# EAGLE design Soil_Moisture_Sensor_SMD-cr (EAGLE 7.4.0)
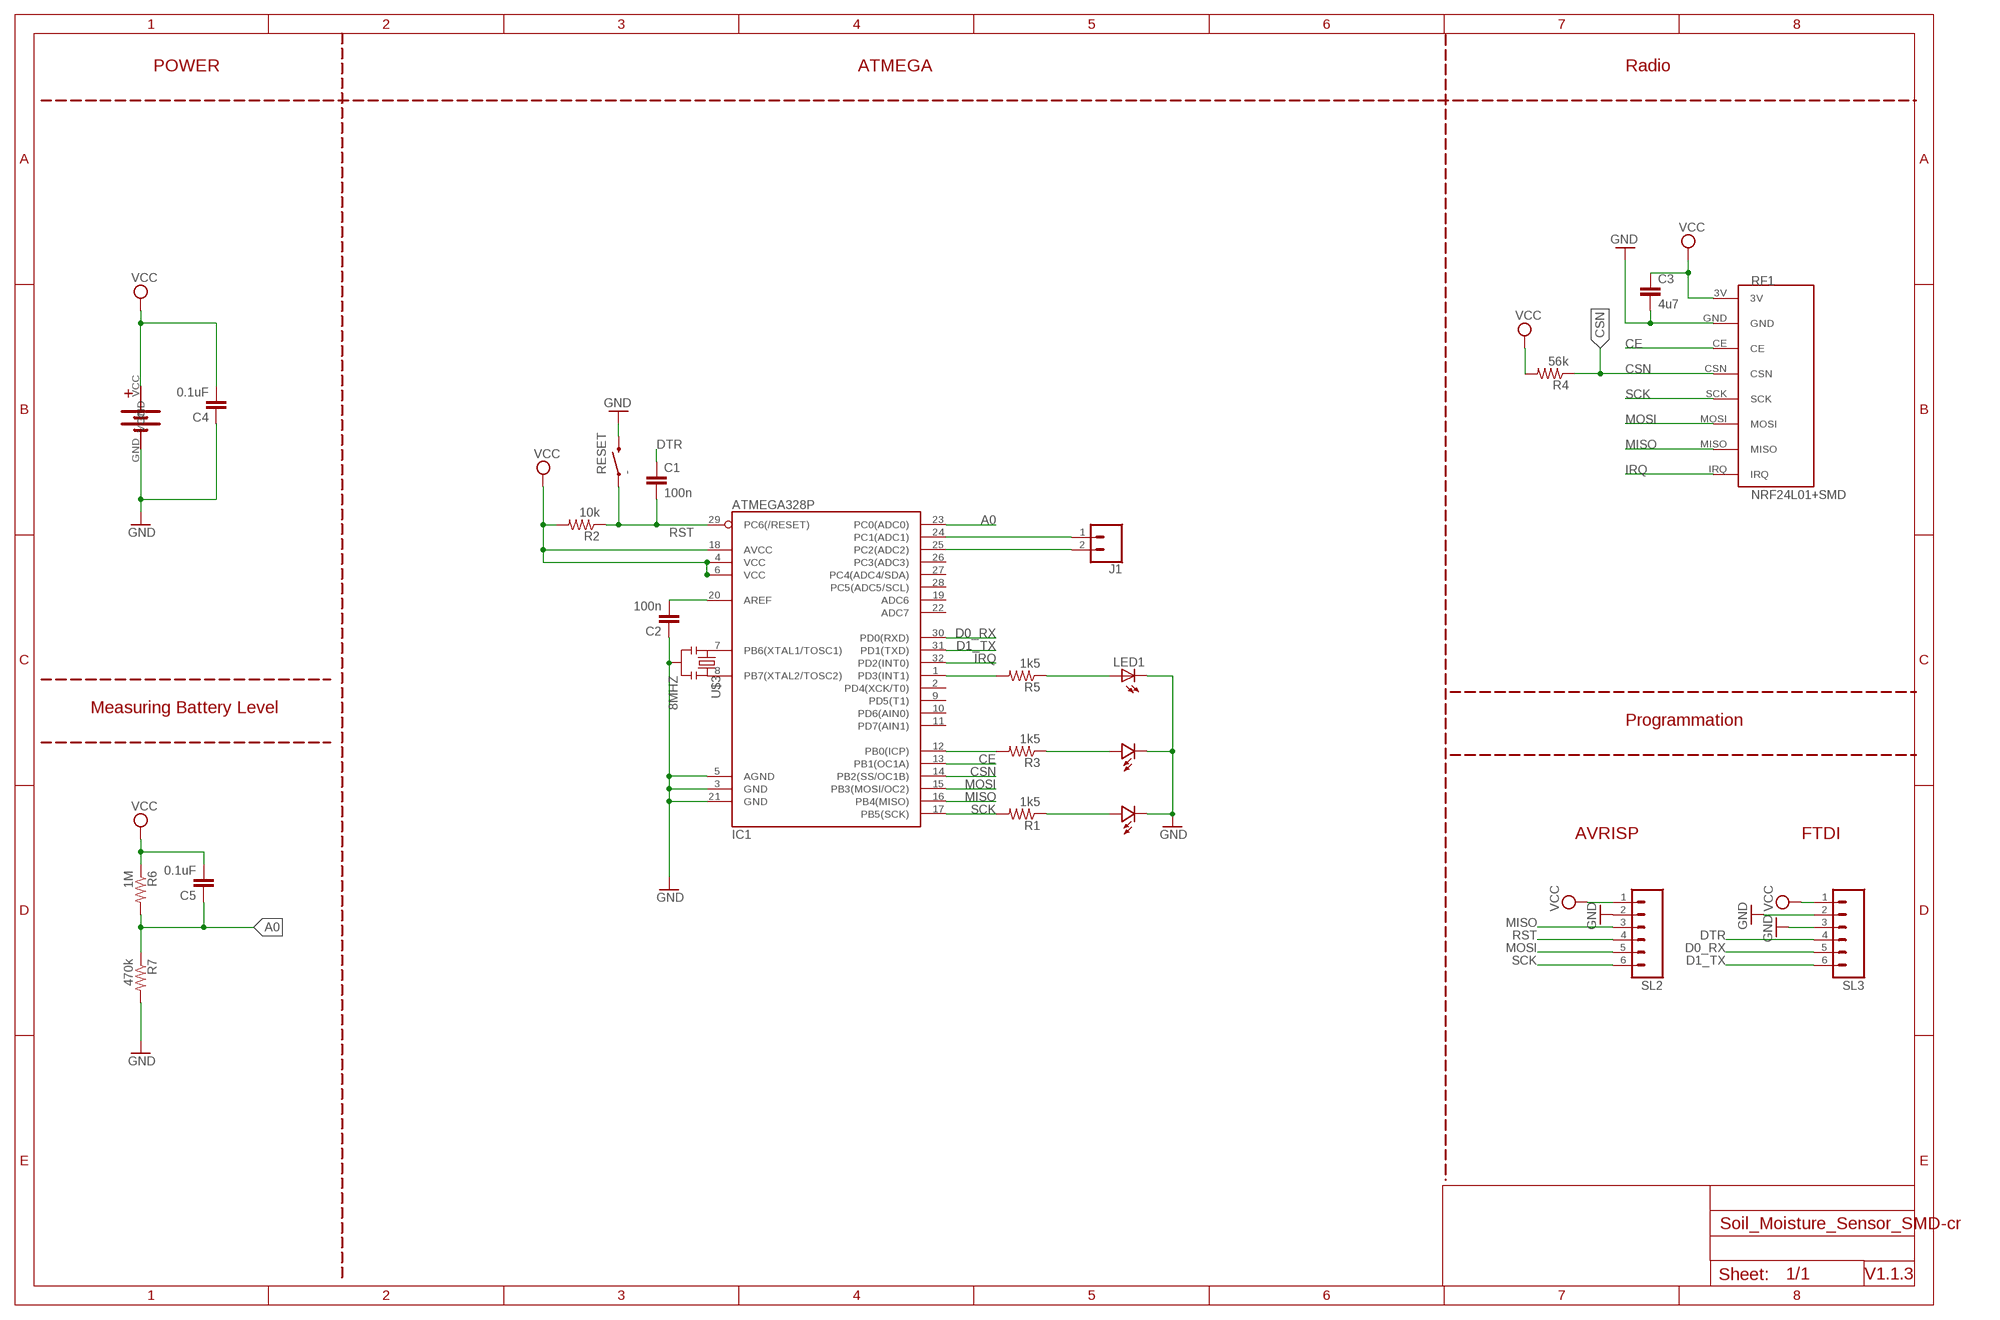
[diagram p0: schematic, sheet 1]

## Parts
C1  100n  CAP0805-CAP  [0805-CAP]
C2  100n  CAP0805-CAP  [0805-CAP]
C3  4u7  CAP0805-CAP  [0805-CAP]
C4  0.1uF  CAP0805-CAP  [0805-CAP]
C5  0.1uF  CAP0805-CAP  [0805-CAP]
D1  LED0805  [0805-LED]
D2  LED0805  [0805-LED]
IC1  ATMEGA328P  ATMEGA168/328TQFP32  [TQFP32-08]
J1  CONN_02  [1X02]
LED1  LED5MM  [LED5MM]
R1  1k5  RESISTOR0805-RES  [0805-RES]
R2  10k  RESISTOR0805-RES  [0805-RES]
R3  1k5  RESISTOR0805-RES  [0805-RES]
R4  56k  RESISTOR0805-RES  [0805-RES]
R5  1k5  RESISTOR0805-RES  [0805-RES]
R6  1M  RESISTOR0805-RES  [0805-RES]
R7  470k  RESISTOR0805-RES  [0805-RES]
RESET  -  SWITCH-MOMENTARY-2-SMD-1101NE  [TACTILE-SWITCH-1101NE]
RF1  NRF24L01+SMD  NRF24L01+SMD_MODULE  [NRF24L01+SMD_MODULE]
SL2  M06SMD-1MM  [1X06-1MM]
SL3  M06SMD-1MM  [1X06-1MM]
U$1  CR123-BATTERYHOLDER  [CR123_BATTERYHOLDER]
U$3  8MHZ  RESONATORSMD  [RESONATOR-SMD]

## Nets
A0: C5.1 IC1.23(PC0(ADC0)) R6.2 R7.1
CE: IC1.13(PB1(OC1A)) RF1.CE
CSN: IC1.14(PB2(SS/OC1B)) R4.1 RF1.CSN
D0_RX: IC1.30(PD0(RXD)) SL3.5
D1_TX: IC1.31(PD1(TXD)) SL3.6
DTR: C1.1 SL3.4
GND [POWER]: C2.1 C3.2 C4.1 D1.MINUS D2.MINUS IC1.3(GND) IC1.5(AGND) IC1.21(GND) LED1.K(C) R7.2 RESET.P$2 RF1.GND SL2.2 SL3.2 SL3.3 U$1.GND U$3.2
IRQ: IC1.32(PD2(INT0)) RF1.IRQ
MISO: IC1.16(PB4(MISO)) RF1.MISO SL2.3
MOSI: IC1.15(PB3(MOSI/OC2)) RF1.MOSI SL2.5
N$1: D2.PLUS R1.1
N$2: IC1.7(PB6(XTAL1/TOSC1)) U$3.1
N$3 [POWER]: IC1.25(PC2(ADC2)) J1.2
N$4: C2.2 IC1.20(AREF)
N$5 [POWER]: IC1.24(PC1(ADC1)) J1.1
N$6: IC1.12(PB0(ICP)) R3.2
N$7: D1.PLUS R3.1
N$8: IC1.8(PB7(XTAL2/TOSC2)) U$3.3
N$9: IC1.1(PD3(INT1)) R5.2
N$10: LED1.A R5.1
RST: C1.2 IC1.29(PC6(/RESET)) R2.1 RESET.P$1 SL2.4
SCK: IC1.17(PB5(SCK)) R1.2 RF1.SCK SL2.6
VCC [POWER]: C3.1 C4.2 C5.2 IC1.4(VCC) IC1.6(VCC) IC1.18(AVCC) R2.2 R4.2 R6.1 RF1.3V SL2.1 SL3.1 U$1.VCC
Unconnected: IC1.2(PD4(XCK/T0)) IC1.9(PD5(T1)) IC1.10(PD6(AIN0)) IC1.11(PD7(AIN1)) IC1.19(ADC6) IC1.22(ADC7) IC1.26(PC3(ADC3)) IC1.27(PC4(ADC4/SDA)) IC1.28(PC5(ADC5/SCL))

## Notes on the sheet
- POWER | ATMEGA | Radio
- Measuring Battery Level
- Programmation
- AVRISP | FTDI
- V1.1.3

## Library data of the parts
C1-C5 = LowPowerLab:CAP: Capacitor Standard 0603 ceramic capacitor, and 0.1" leaded capacitor.
D1 D2 = LowPowerLab:LED
IC1 = LowPowerLab:ATMEGA168/328: Atmel 32-pin 8-bit micro, 16k flash.
J1 = SparkFun-Connectors:CONN_02: Multi connection point. Often used as Generic Header-pin footprint for 0.1 inch spaced/style header connections On any of the 0.1 inch spaced packages, you can populate with these: Break Away Headers - Straight <https://www.sparkfun.com/products/116> (PRT-00116) Break Away Male Headers - Right Angle <https://www.sparkfun.com/products/553> (PRT-00553) Female Headers <https://www.sparkfun.com/products/115> (PRT-00115) Break Away Headers - Machine Pin <https://www.sparkfun.com/products/117> (PRT-00117) Break Away Female Headers - Swiss Machine Pin <https://www.sparkfun.com/products/743> (PRT-00743) For SCREWTERMINALS and SPRING TERMINALS visit here: Screw Terimnals on SparkFun.com <https://www.sparkfun.com/search/results?term=Screw+Terminals> (5mm/3.5mm/2.54mm spacing) This device is also useful as a general connection point to wire up your design to another part of your project. Our various solder wires solder well into these plated through hole pads. Hook-Up Wire - Assortment (Stranded, 22 AWG) <https://www.sparkfun.com/products/11375> (PRT-11375) Hook-Up Wire - Assortment (Solid Core, 22 AWG) <https://www.sparkfun.com/products/11367> (PRT-11367) View the entire wire category on our website here <https://www.sparkfun.com/categories/141> Special notes: Molex polarized connector foot print use with: PRT-08233 with associated crimp pins and housings. 2.54_SCREWTERM for use with PRT-10571. 3.5mm Screw Terminal footprints for PRT-08084 5mm Screw Terminal footprints for use with PRT-08432
LED1 = led:LED: LED OSRAM: - CHIPLED LG R971, LG N971, LY N971, LG Q971, LY Q971, LO R971, LY R971 LH N974, LH R974 LS Q976, LO Q976, LY Q976 LO Q996 - Hyper CHIPLED LW Q18S LB Q993, LB Q99A, LB R99A - SideLED LS A670, LO A670, LY A670, LG A670, LP A670 LB A673, LV A673, LT A673, LW A673 LH A674 LY A675 LS A676, LA A676, LO A676, LY A676, LW A676 LS A679, LY A679, LG A679 - Hyper Micro SIDELED® LS Y876, LA Y876, LO Y876, LY Y876 LT Y87S - SmartLED LW L88C, LW L88S LB L89C, LB L89S, LG L890 LS L89K, LO L89K, LY L89K LS L896, LA L896, LO L896, LY L896 - TOPLED LS T670, LO T670, LY T670, LG T670, LP T670 LSG T670, LSP T670, LSY T670, LOP T670, LYG T670 LG T671, LOG T671, LSG T671 LB T673, LV T673, LT T673, LW T673 LH T674 LS T676, LA T676, LO T676, LY T676, LB T676, LH T676, LSB T676, LW T676 LB T67C, LV T67C, LT T67C, LS T67K, LO T67K, LY T67K, LW E67C LS E67B, LA E67B, LO E67B, LY E67B, LB E67C, LV E67C, LT E67C LW T67C LS T679, LY T679, LG T679 LS T770, LO T770, LY T770, LG T770, LP T770 LB T773, LV T773, LT T773, LW T773 LH T774 LS E675, LA E675, LY E675, LS T675 LS T776, LA T776, LO T776, LY T776, LB T776 LHGB T686 LT T68C, LB T68C - Hyper Mini TOPLED® LB M676 - Mini TOPLED Santana® LG M470 LS M47K, LO M47K, LY M47K Source: http://www.osram.convergy.de LUXEON: - LUMILED® LXK2-PW12-R00, LXK2-PW12-S00, LXK2-PW14-U00, LXK2-PW14-V00 LXK2-PM12-R00, LXK2-PM12-S00, LXK2-PM14-U00 LXK2-PE12-Q00, LXK2-PE12-R00, LXK2-PE12-S00, LXK2-PE14-T00, LXK2-PE14-U00 LXK2-PB12-K00, LXK2-PB12-L00, LXK2-PB12-M00, LXK2-PB14-N00, LXK2-PB14-P00, LXK2-PB14-Q00 LXK2-PR12-L00, LXK2-PR12-M00, LXK2-PR14-Q00, LXK2-PR14-R00 LXK2-PD12-Q00, LXK2-PD12-R00, LXK2-PD12-S00 LXK2-PH12-R00, LXK2-PH12-S00 LXK2-PL12-P00, LXK2-PL12-Q00, LXK2-PL12-R00 Source: www.luxeon.com KINGBRIGHT: KA-3528ASYC Source: www.kingbright.com
R1-R7 = LowPowerLab:RESISTOR: Resistor Basic schematic elements and footprints for 0603, 1206, and PTH resistors.
RESET = SparkFun:SWITCH-MOMENTARY-2
RF1 = rollershutter:NRF24L01+SMD_MODULE
SL2 SL3 = SparkFun-Connectors:M06: Header 6 Standard 6-pin 0.1" header. Use with straight break away headers (SKU : PRT-00116), right angle break away headers (PRT-00553), swiss pins (PRT-00743), machine pins (PRT-00117), and female headers (PRT-00115). Molex polarized connector foot print use with SKU : PRT-08094 with associated crimp pins and housings. NOTES ON THE VARIANTS LOCK and LOCK_LONGPADS... This footprint was designed to help hold the alignment of a through-hole component (i.e. 6-pin header) while soldering it into place. You may notice that each hole has been shifted either up or down by 0.005 of an inch from it's more standard position (which is a perfectly straight line). This slight alteration caused the pins (the squares in the middle) to touch the edges of the holes. Because they are alternating, it causes a "brace" to hold the component in place. 0.005 has proven to be the perfect amount of "off-center" position when using our standard breakaway headers. Although looks a little odd when you look at the bare footprint, once you have a header in there, the alteration is very hard to notice. Also,if you push a header all the way into place, it is covered up entirely on the bottom side. This idea of altering the position of holes to aid alignment will be further integrated into the Sparkfun Library for other footprints. It can help hold any component with 3 or more connection pins.
U$1 = JRS-CR123-BatteryHolder:CR123-BATTERYHOLDER: CR123 Lithium Battery Holder
U$3 = SparkFun:RESONATOR: Resonator Small SMD resonator. This is the itty bitty 10/20MHz resonators with built in caps. CSTCE10M0G55 and CSTCE20M0V53. Footprint has been reviewed closely but hasn't been tested yet.

## Net classes
0 default: clearance 0.205 mm
1 POWER: width 0.457 mm, clearance 0.205 mm to class 0, clearance 0.254 mm

## Board
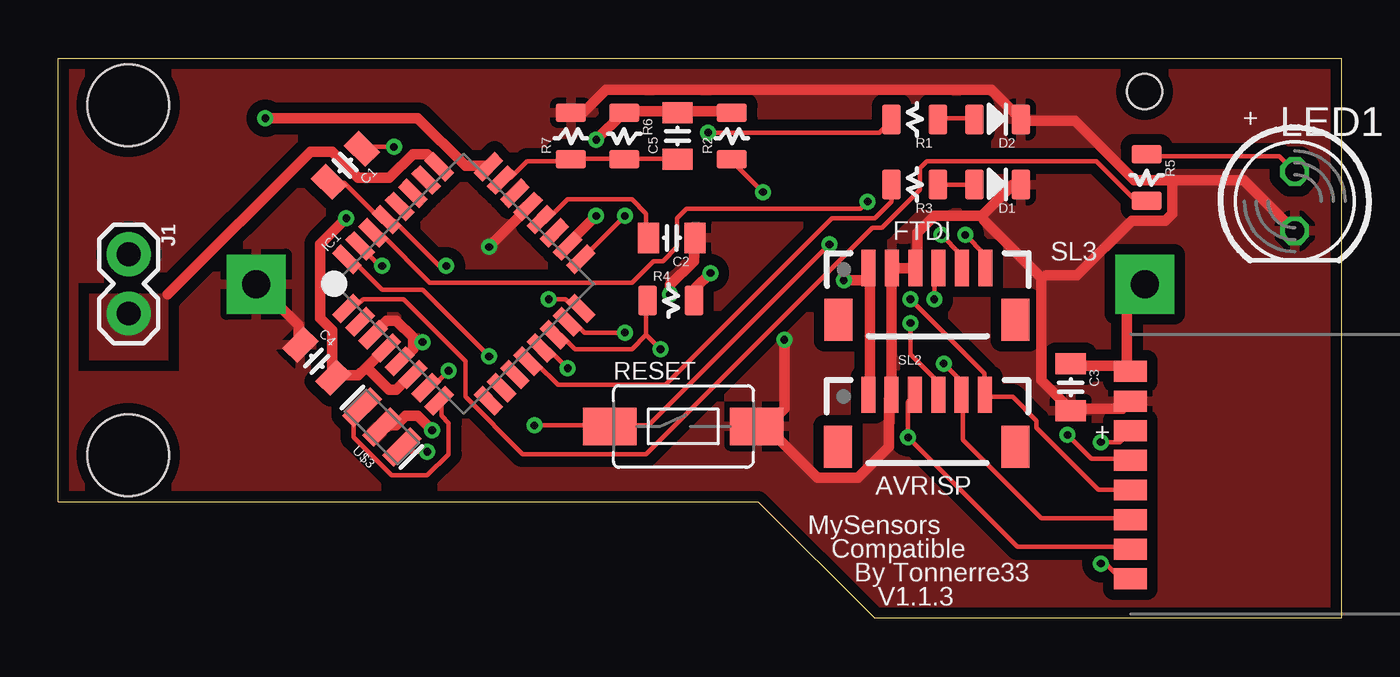
[diagram p1: board, top side]
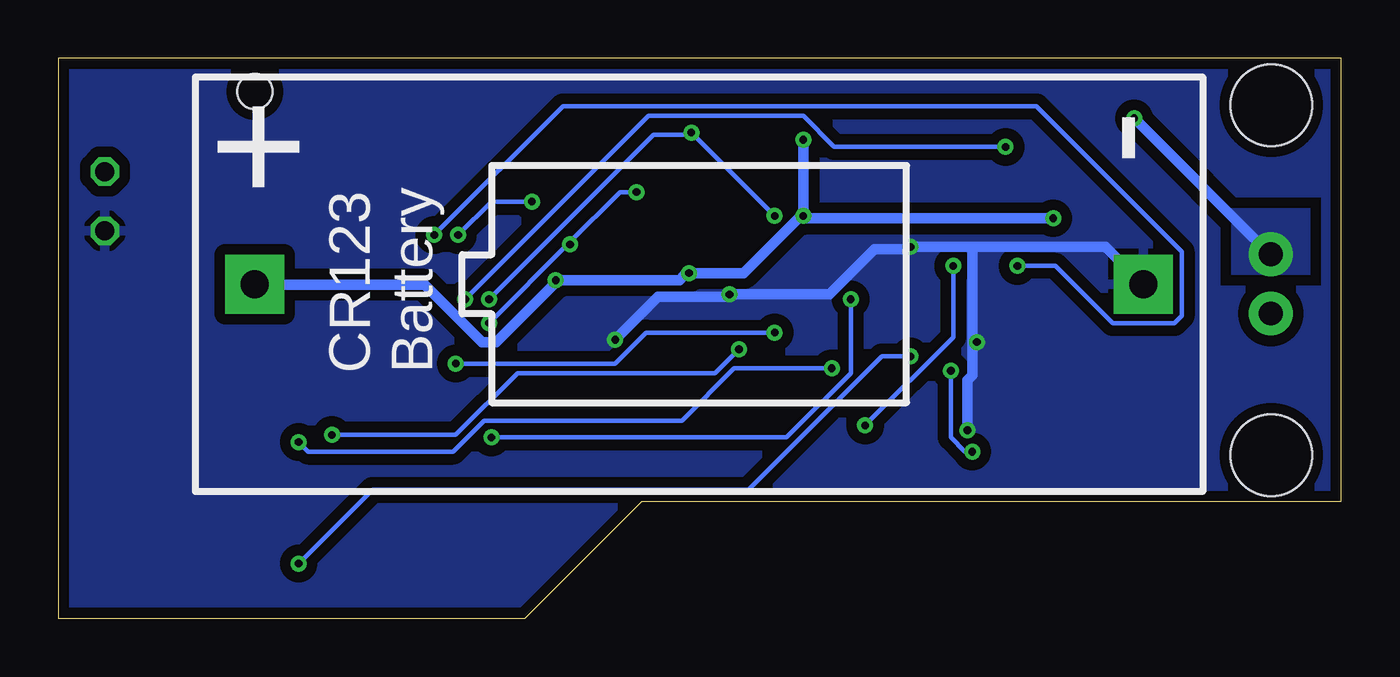
[diagram p2: board, bottom side, seen from below]

Size 55 x 24 mm. Coordinates in mm from the lower left corner, seen from the top.
Outline: 55,0 35,0 30,5 0,5 0,24 55,24 55,0
Copper layers (1*16): Top 0.0356mm / dielectric 1.5011mm / Bottom 0.0356mm
Design rules "PCBs_io-8mil-jby *": minimum track width 8mil, minimum drill 13mil, track to track 8mil, track to pad 8mil, pad to pad 8mil, via to via 8mil, smd to smd 8mil, copper to edge 15mil, drill to drill 8mil, minimum pad ring 7mil, minimum via ring 7mil, stop-mask expansion 3mil, vias tented up to drill 13mil, thermal gap 10mil
Holes 3.5 mm at 3,22 3,7

### Footprints (pad centres in the part's own frame; a part is rotated, then mirrored left to right if it is on the bottom)
0805-CAP = smd 0.902 x 1.3: 1 -1,0; 2 1,0
0805-LED = smd 0.8 x 1.3: MINUS -1,0; PLUS 1,0
TQFP32-08 = smd 1.27 x 0.533: 1 -4.293,2.8; 2 -4.293,2; 3 -4.293,1.2; 4 -4.293,0.4; 5 -4.293,-0.4; 6 -4.293,-1.2; 7 -4.293,-2; 8 -4.293,-2.8; 17 4.293,-2.8; 18 4.293,-2; 19 4.293,-1.2; 20 4.293,-0.4; 21 4.293,0.4; 22 4.293,1.2; 23 4.293,2; 24 4.293,2.8 | smd 0.533 x 1.27: 9 -2.8,-4.293; 10 -2,-4.293; 11 -1.2,-4.293; 12 -0.4,-4.293; 13 0.4,-4.293; 14 1.2,-4.293; 15 2,-4.293; 16 2.8,-4.293; 25 2.8,4.293; 26 2,4.293; 27 1.2,4.293; 28 0.4,4.293; 29 -0.4,4.293; 30 -1.2,4.293; 31 -2,4.293; 32 -2.8,4.293
1X02 = drill 1.016 pad 1.88: 1 0,0; 2 2.54,0
LED5MM = drill 0.813 octagon: A -1.27,0; K 1.27,0
0805-RES = smd 0.8 x 1.3: 1 -1,0; 2 1,0
TACTILE-SWITCH-1101NE = smd 2.3 x 1.6: P$1 -3.15,0; P$2 3.15,0
NRF24L01+SMD_MODULE = smd 0.9 x 1.4: 3V -4.8,-9.6; CE -2.26,-9.6; CSN -0.99,-9.6; GND -3.53,-9.6; IRQ 4.09,-9.6; MISO 2.82,-9.6; MOSI 1.55,-9.6; SCK 0.28,-9.6
1X06-1MM = smd 0.6 x 1.55: 1 -2.54,1.27; 2 -1.54,1.27; 3 -0.54,1.27; 4 0.46,1.27; 5 1.46,1.27; 6 2.46,1.27 | smd 1.2 x 1.8: P$1 -3.84,-0.955; P$2 3.76,-0.955
CR123_BATTERYHOLDER = drill 1.2 pad 2.54 square: GND 0,-19.05; VCC 0,19.05 | hole 1.5: 8.255,19.05
RESONATOR-SMD = smd 0.7 x 1.7: 1 -1.2,0; 2 0,0; 3 1.2,0

### Placement (x,y rotation side)
C1  12.3,19.42 225 top
C2  26.31,16.3 180 top
C3  43.4,9.91 270 top
C4  11.08,11.02 315 top
C5  26.54,20.67 90 top
D1  40.28,18.59 180 top
D2  40.28,21.38 180 top
IC1  17.38,14.34 45 top
J1  3.02,15.61 270 top
LED1  53.01,17.88 270 top
R1  36.72,21.38 180 top
R2  28.88,20.67 90 top
R3  36.72,18.59 180 top
R4  26.26,13.62 0 top
R5  46.66,18.89 270 top
R6  24.26,20.67 270 top
R7  21.97,20.67 90 top
RESET  26.8,8.22 0 top
RF1  55.56,5.78 270 top
SL2  37.26,8.31 0 top
SL3  37.28,13.74 0 top
U$1  27.53,14.32 90 bottom
U$3  13.87,8.2 135 top

### Tracks (layer width: path | path; a pad name or v marks a point on that pad's centre or on a via)
A0
  Top 0.203: IC1.23 19.08,18.88 19.39,18.88 20.1,19.59 21.94,19.59 R7.1 22.04,19.7 24.19,19.7 R6.2 24.29,19.7 26.53,19.7 C5.1
CE  (via drill 0.33)
  Top 0.203: v21.84,10.71 21.02,11.53 20.72,11.53 IC1.13 | v44.7,7.55 45.51,7.55 45.92,7.96 RF1.CE
  Bottom 0.203: v21.84,10.71 26.02,10.71 28.27,8.47 36.74,8.47 38.06,7.14 44.29,7.14 v44.7,7.55
CSN  (via drill 0.33)
  Top 0.203: 25.21,12.14 24.59,11.53 22.14,11.53 21.53,12.14 21.33,12.14 IC1.14 | 25.21,12.14 25.21,13.57 R4.1 | v43.27,7.86 44.29,6.84 45.92,6.84 RF1.CSN | 25.21,12.14 v25.82,11.53
  Bottom 0.203: v43.27,7.86 37.96,7.86 35.31,10.51 26.84,10.51 v25.82,11.53
D0_RX  (via drill 0.33)
  Top 0.203: v34.7,17.86 34.39,17.55 26.94,17.55 26.53,17.14 26.53,15.92 25.92,15.31 25.51,15.31 24.59,14.39 15.92,14.39 13.88,16.43 13.57,16.43 IC1.30 | v37.86,16.43 38.68,15.61 38.68,15.1 SL3.5
  Bottom 0.203: v34.7,17.86 36.43,17.86 v37.86,16.43
D1_TX  (via drill 0.33)
  Top 0.203: v13.88,15.1 13.78,15.1 12.96,15.92 IC1.31 | v38.88,16.43 39.7,15.61 39.7,15.1 SL3.6
  Bottom 0.203: v13.88,15.1 12.25,15.1 9.8,12.65 7.14,12.65 6.84,12.96 6.84,15.72 13.06,21.94 33.37,21.94 v38.88,16.43
DTR  (via drill 0.33)
  Top 0.203: v14.39,20.21 13.06,20.21 C1.1 | v37.55,13.68 37.55,14.9 37.66,15 SL3.4
  Bottom 0.203: v14.39,20.21 21.74,20.21 23.06,21.53 29.7,21.53 v37.55,13.68
GND  (via drill 0.33)
  Top 0.457: 15.21,11.84 15.21,12.04 14.49,12.76 14.08,12.76 13.57,12.25 IC1.3 | 15.21,11.84 15.21,11.53 14.7,11.02 IC1.5 | v18.47,15.92 20.1,17.55 IC1.21 | C4.1 10.31,11.74 10.31,12.55 8.57,14.29 U$1.GND | v26.23,13.88 26.23,14.29 27.25,15.31 27.25,16.23 C2.1 | v16.02,8.06 15.41,8.67 14.9,8.67 14.49,8.27 13.88,8.27 U$3.2 | v15.61,11.84 15.21,11.84 | RF1.GND 45.92,9.29 45.62,8.98 43.47,8.98 C3.2 43.27,9.08 42.15,10.21 42.15,14.59 | 39.59,17.25 40.92,18.57 41.23,18.57 D1.MINUS | 39.59,17.25 37.55,17.25 36.84,16.53 36.84,15.1 SL3.3 36.53,15 35.92,15 SL3.2 35.72,15 35.72,9.59 SL2.2 35.62,9.39 35.62,7.35 34.29,6.02 32.55,6.02 30.41,8.16 30,8.16 RESET.P$2 30.51,8.37 31.12,8.98 v31.12,11.94 | 42.15,14.59 39.7,17.04 39.59,17.25 | 47.76,18.78 50.82,18.78 52.96,16.63 LED1.K | 47.76,18.78 46.13,18.78 43.58,21.33 41.33,21.33 D2.MINUS 41.13,21.53 40,22.66 23.47,22.66 22.55,21.74 22.04,21.74 R7.2 | 47.76,18.78 47.76,17.35 47.45,17.04 46.02,17.04 43.68,14.7 42.35,14.7 42.15,14.59
  Bottom 0.457: 15.82,15.92 10.1,15.92 8.57,14.39 U$1.GND | 15.82,15.92 v18.47,15.92 18.68,15.82 20,15.82 21.94,13.88 v26.23,13.88 26.43,13.78 29.29,13.78 v31.12,11.94 | v16.02,8.06 16.02,10.21 15.82,10.41 15.82,11.84 | 15.82,15.92 15.82,11.84 | v15.61,11.84 15.82,11.84
  pour Bottom (isolate 0.457, rank 2): 97.2,28.62 97.2,-3.87 -5.06,-3.87 -5.06,28.62
  pour Top (isolate 0.457, rank 2): -1.86,26.61 -1.86,-1.86 63.94,-1.86 63.94,26.61
IRQ  (via drill 0.33)
  Top 0.203: v18.47,11.23 15.61,14.08 13.88,14.08 12.65,15.31 12.45,15.31 IC1.32 | v44.7,2.35 44.9,2.35 45.51,1.74 45.92,1.74 RF1.IRQ
  Bottom 0.203: v18.47,11.23 19.7,11.23 25.41,5.51 41.53,5.51 v44.7,2.35
MISO  (via drill 0.33)
  Top 0.203: v21.02,13.68 21.74,13.68 22.04,13.37 22.35,13.37 IC1.16 | SL2.3 36.64,9.49 36.43,9.29 v36.43,7.76 41.13,3.06 45.92,3.06 RF1.MISO
  Bottom 0.203: v21.02,13.68 21.02,10.51 23.78,7.76 v36.43,7.76
MOSI  (via drill 0.33)
  Top 0.203: v24.29,12.25 22.55,12.25 22.14,12.65 21.84,12.65 IC1.15 | v37.96,10.92 38.68,10.21 38.68,9.59 SL2.5 38.78,9.49 38.78,7.65 42.15,4.29 45.92,4.29 RF1.MOSI
  Bottom 0.203: v24.29,12.25 29.8,12.25 31.12,10.92 v37.96,10.92
N$1
  Top 0.203: R1.1 37.76,21.43 39.19,21.43 D2.PLUS
N$2  (via drill 0.33)
  Top 0.203: v16.74,10.61 16.02,9.9 15.82,9.9 IC1.7 | v15.82,7.14 15,7.14 14.8,7.35 U$3.1
  Bottom 0.203: v16.74,10.61 16.74,7.76 16.12,7.14 v15.82,7.14
N$3
  Top 0.457: 4.69,13.88 10.82,20 11.74,20 12.86,18.88 14.19,18.88 15.21,19.9 15.82,19.9 16.33,19.39 IC1.25
  pour Top (isolate 0.457, no thermals): 1.32,13.91 1.32,11.07 4.72,11.07 4.72,13.91
N$4
  Top 0.203: IC1.20 20.72,17.14 21.02,17.14 21.84,17.96 24.59,17.96 25.21,17.35 25.21,16.33 C2.2
N$5  (via drill 0.33)
  Top 0.457: v8.88,21.43 15.41,21.43 17.45,19.39 18.37,19.39 IC1.24 | 3.06,15.61 J1.1
  Bottom 0.457: v8.88,21.43 3.05,15.61 J1.1
  pour Bottom (isolate 0.457, no thermals): 1.32,17.57 1.32,14.73 4.72,14.73 4.72,17.57
N$6
  Top 0.203: IC1.12 20.21,10.92 20.51,10.92 21.43,10 26.02,10 33.17,17.14 35,17.14 35.72,17.86 35.72,18.57 R3.2
N$7
  Top 0.203: R3.1 37.76,18.57 39.19,18.57 D1.PLUS
N$8
  Top 0.203: IC1.8 16.43,9.29 16.43,8.67 16.74,8.37 16.74,7.04 15.82,6.12 14.29,6.12 12.65,7.76 12.65,8.67 12.96,8.98 U$3.3
N$9
  Top 0.203: IC1.1 12.45,13.37 12.76,13.37 13.06,13.68 14.8,13.68 17.45,11.02 17.45,9.49 19.9,7.04 25.21,7.04 34.9,16.74 35.31,16.74 36.94,18.37 36.94,19.29 37.25,19.59 44.49,19.59 46.13,17.96 46.64,17.96 R5.2
N$10
  Top 0.203: R5.1 46.74,19.8 52.35,19.8 52.96,19.18 LED1.A
RST  (via drill 0.33)
  Top 0.203: C1.2 11.63,18.68 12.25,18.68 13.78,17.14 13.98,17.14 IC1.29 14.08,17.04 14.39,17.04 16.33,15.1 v16.63,15.1 | v30.21,18.27 28.88,19.59 R2.1 | v36.53,12.65 36.53,11.33 37.66,10.21 37.66,9.59 SL2.4 | v33.06,16.02 25.31,8.27 23.68,8.27 RESET.P$1 23.57,8.27 v20.41,8.27
  Bottom 0.203: v30.21,18.27 30.92,18.27 33.12,16.07 | v36.53,12.65 33.12,16.07 | v33.06,16.02 33.12,16.07 | v16.63,15.1 16.63,12.04 v20.41,8.27
SCK  (via drill 0.33)
  Top 0.203: RF1.SCK 45.92,5.51 44.6,5.51 41.94,8.16 41.94,8.47 40.92,9.49 39.8,9.49 SL2.6 39.7,9.59 39.7,10.51 v36.53,13.68 | v24.29,17.25 22.45,15.41 IC1.17 | v27.86,20.82 35.21,20.82 35.72,21.33 R1.2
  Bottom 0.203: v24.29,17.25 v27.86,20.82 27.86,20.72 29.49,20.72 v36.53,13.68
VCC  (via drill 0.33)
  Top 0.457: C3.1 43.47,10.82 45.72,10.82 45.92,10.61 RF1.3V 45.82,11.02 45.82,13.57 46.53,14.29 U$1.VCC | SL2.1 34.8,9.59 34.8,15 SL3.1 34.59,14.49 v33.68,14.49 | 13.21,10.77 12.86,10.41 11.84,10.41 C4.2 11.74,10.61 11.74,12.35 11.23,12.86 11.23,16.02 v12.35,17.14 | 13.21,10.77 13.98,11.53 IC1.4 | 13.21,10.77 14.19,9.8 14.49,9.8 15.1,10.41 IC1.6 | v23.06,17.25 21.84,16.02 IC1.18 | v23.06,20.51 24.19,21.64 R6.1 24.39,21.74 26.53,21.74 C5.2 26.74,21.74 28.78,21.74 R2.2 | v27.96,14.8 27.35,14.19 27.35,13.68 R4.2
  Bottom 0.457: v23.06,20.51 v23.06,17.25 | v23.06,17.25 23.27,17.14 25.61,14.8 v27.96,14.8 28.17,14.7 28.37,14.49 v33.68,14.49 33.78,14.29 36.23,11.84 36.84,11.84 39.29,14.29 46.53,14.29 U$1.VCC | v12.35,17.14 22.86,17.14 v23.06,17.25

### Text on the board
tPlace: + | FTDI | + | AVRISP | MySensors | Compatible | By Tonnerre33 | V1.1.3